# EAGLE schematic Schematic v24 (EAGLE 9.7.0)
Assembly variants: PCB
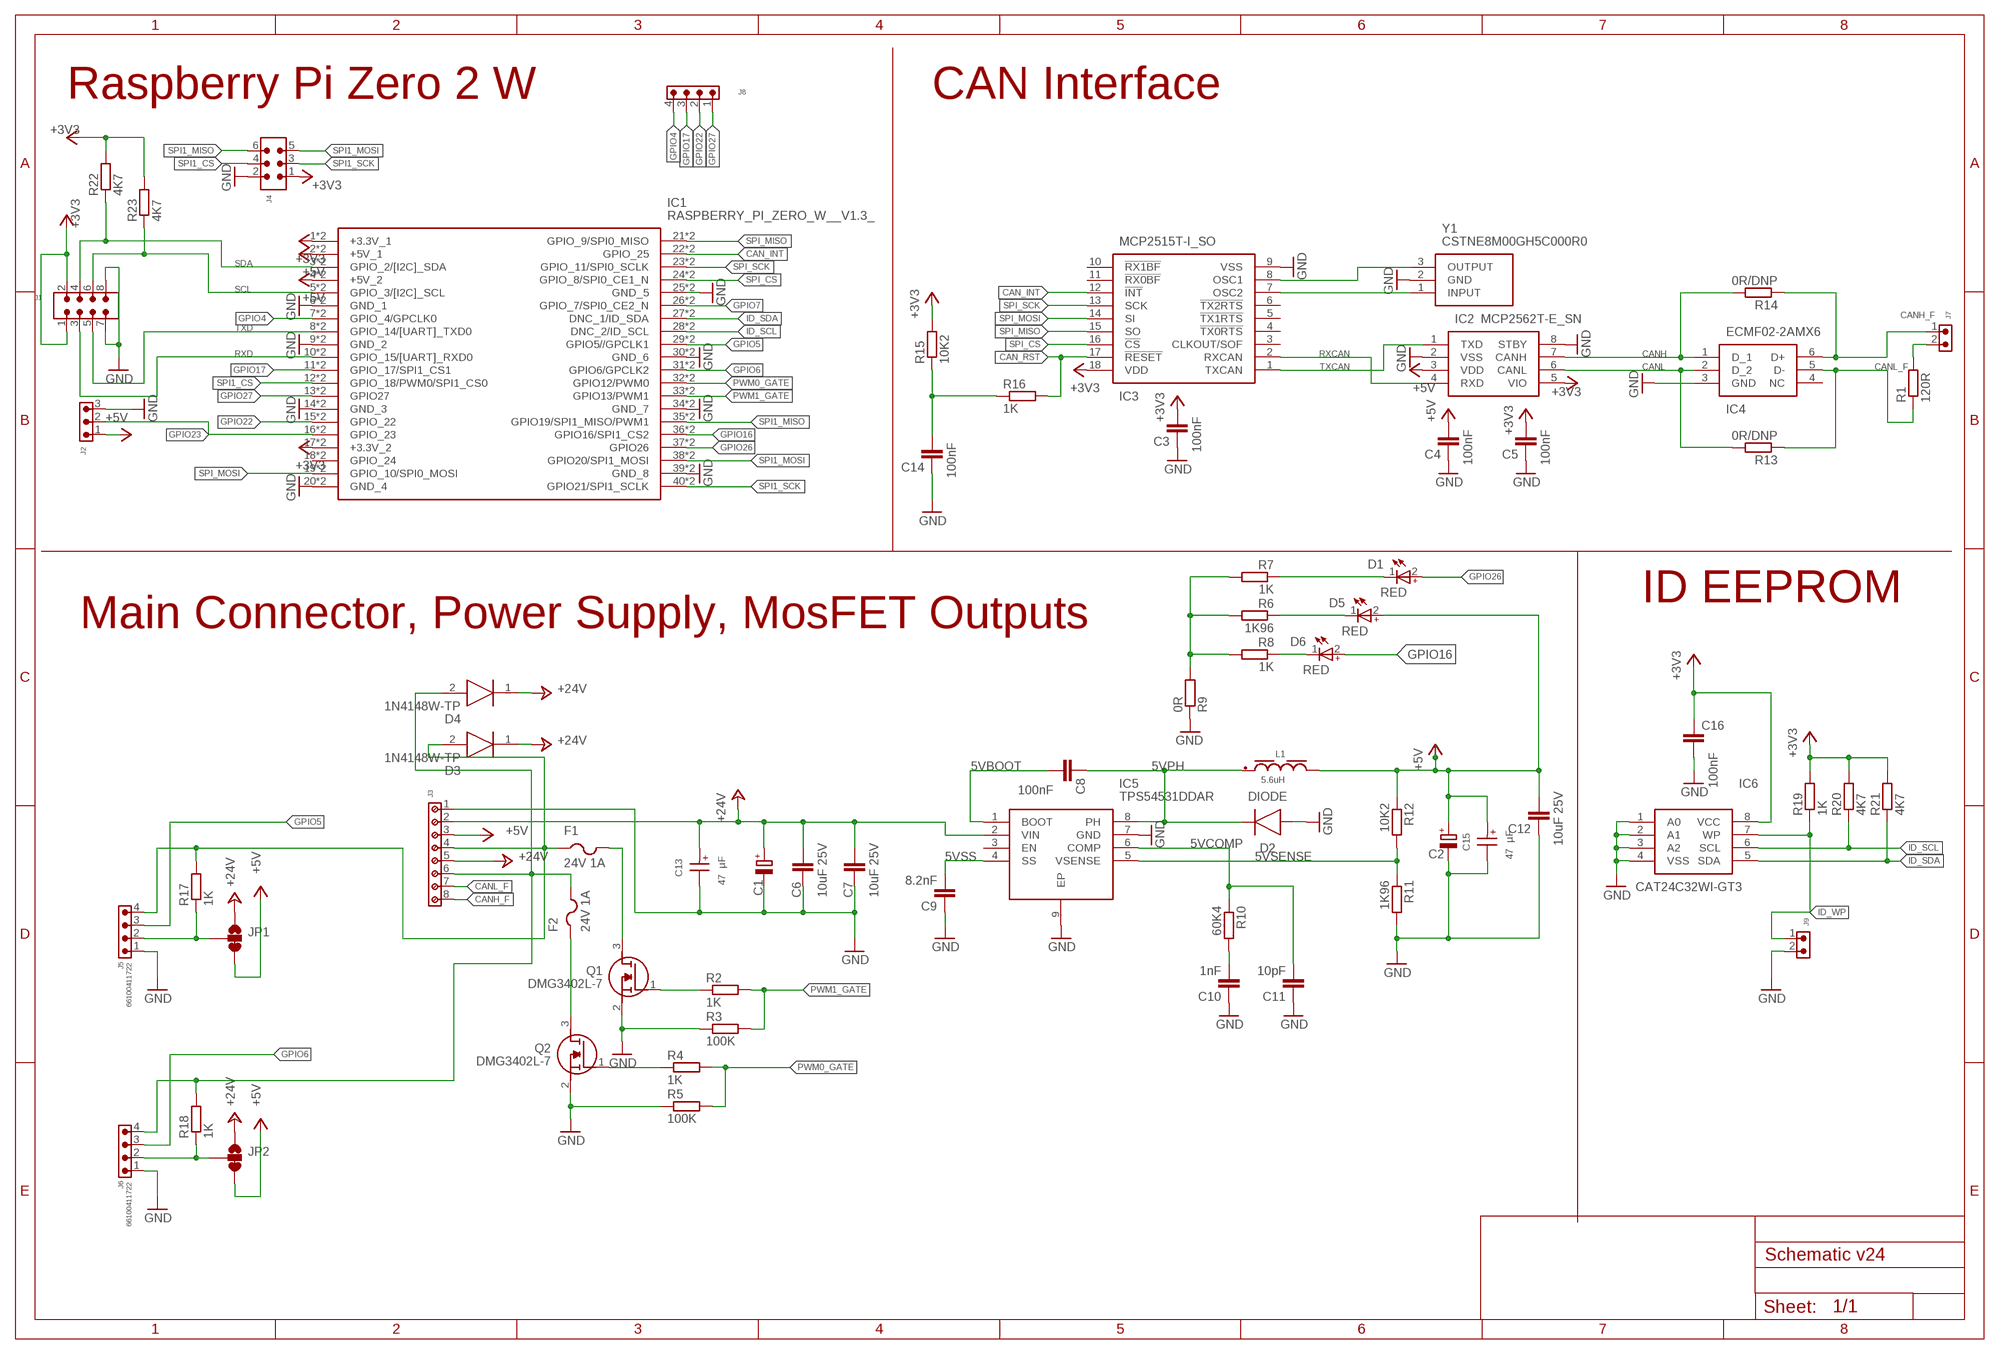
[diagram p0: schematic, sheet 1]

## Parts
C1  CPOL-EUE3.5-8  [E3,5-8]
C2  CPOL-EUE3.5-8  [E3,5-8]
C3  100nF  C-EUC0603K  [C0603K]
C4  100nF  C-EUC0603K  [C0603K]
C5  100nF  C-EUC0603K  [C0603K]
C6  10uF 25V  C-EUC1210K  [C1210K]
C7  10uF 25V  C-EUC1210K  [C1210K]
C8  100nF  C-EUC0603K  [C0603K]
C9  8.2nF  C-EUC0603K  [C0603K]
C10  1nF  C-EUC0603K  [C0603K]
C11  10pF  C-EUC0603K  [C0603K]
C12  10uF 25V  C-EUC1210K  [C1210K]
C13  47 µF  WCAP-ASLL_5X5.5_865060142003  [WCAP-ASLL_5X5.5(DXL)]
C14  100nF  C-EUC0603K  [C0603K]
C15  47 µF  WCAP-ASLL_5X5.5_865060142003  [WCAP-ASLL_5X5.5(DXL)]
C16  100nF  C-EUC0603K  [C0603K]
D1  RED  WL-SMCC_0603_R_V_Y_150060RS73220  [WL-SMCC_0603_R_Y_V]
D2  DIODE  DIODEDO-214AB(SMC)  [DIOM7959X625N]
D3  1N4148W-TP  [SOD3716X135N]
D4  1N4148W-TP  [SOD3716X135N]
D5  RED  WL-SMCC_0603_R_V_Y_150060RS73220  [WL-SMCC_0603_R_Y_V]
D6  RED  WL-SMCC_0603_R_V_Y_150060RS73220  [WL-SMCC_0603_R_Y_V]
F1  24V 1A  PTCFUSE-1206  [R1206]
F2  24V 1A  PTCFUSE-1206  [R1206]
IC1  RASPBERRY_PI_ZERO_W__V1.3_  [RASPBERRYPIZEROWV13]
IC2  MCP2562T-E_SN  [SOIC127P600X175-8N]
IC3  MCP2515T-I_SO  [SOIC127P1030X265-18N]
IC4  ECMF02-2AMX6  [SON50P150X170X55-6N]
IC5  TPS54531DDAR  [SOIC127P600X170-9N]
IC6  CAT24C32WI-GT3  [SOIC127P600X175-8N]
J1  6130XX21121_61300821121  [61300821121]
J2  6130XX11121_61300311121  [61300311121]
J3  691243110008  [691243110008]
J4  6130XX21121_61300621121  [61300621121]
J5  66100411722  66100411722  [66100411722]
J6  66100411722  66100411722  [66100411722]
J7  6130XX11121_61300211121  [61300211121]
J8  6130XX11021_61300411021  [61300411021]
J9  6130XX11121_61300211121  [61300211121]
JP1  JUMPER-SMT_3_1-NC_TRACE_NO-SILK  [SMT-JUMPER_3_1-NC_TRACE_NO-SILK]
JP2  JUMPER-SMT_3_1-NC_TRACE_NO-SILK  [SMT-JUMPER_3_1-NC_TRACE_NO-SILK]
L1  5.6uH  WE-PD_1050P_7447714056  [WE-PD_1050P]
Q1  DMG3402L-7  [SOT96P240X110-3N]
Q2  DMG3402L-7  [SOT96P240X110-3N]
R1  120R  R-EU_R0603  [R0603]
R2  1K  R-EU_R0603  [R0603]
R3  100K  R-EU_R0603  [R0603]
R4  1K  R-EU_R0603  [R0603]
R5  100K  R-EU_R0603  [R0603]
R6  1K96  R-EU_R0603  [R0603]
R7  1K  R-EU_R0603  [R0603]
R8  1K  R-EU_R0603  [R0603]
R9  0R  R-EU_R0603  [R0603]
R10  60K4  R-EU_R0603  [R0603]
R11  1K96  R-EU_R0603  [R0603]
R12  10K2  R-EU_R0603  [R0603]
R13  0R/DNP  R-EU_R0603  [R0603]
R14  0R/DNP  R-EU_R0603  [R0603]
R15  10K2  R-EU_R0603  [R0603]
R16  1K  R-EU_R0603  [R0603]
R17  1K  R-EU_R0603  [R0603]
R18  1K  R-EU_R0603  [R0603]
R19  1K  R-EU_R0603  [R0603]
R20  4K7  R-EU_R0603  [R0603]
R21  4K7  R-EU_R0603  [R0603]
R22  4K7  R-EU_R0603  [R0603]
R23  4K7  R-EU_R0603  [R0603]
Y1  CSTNE8M00GH5C000R0  [CSTNE12M0GH5L000R0]

## Nets
5VBOOT: C8.2 IC5.1(BOOT)
5VCOMP: C11.2 IC5.6(COMP) R10.1
5VPH: C8.1 D2.1(C) IC5.8(PH) L1.1
5VSENSE: IC5.5(VSENSE) R11.1 R12.2
5VSS: C9.2 IC5.4(SS)
+3V3: C3.2 C5.2 C16.1 IC1.1(+3.3V_1) IC1.1.2(+3.3V_1) IC1.17(+3.3V_2) IC1.17.2(+3.3V_2) IC2.5(VIO) IC3.18(VDD) IC6.8(VCC) J1.1 J1.2 J4.1 R15.2 R19.2 R20.2 R21.2 R22.2 R23.2
+5V: C2.+ C4.2 C12.2 C15.1(+) D5.2(+) IC1.2(+5V_1) IC1.2.2(+5V_1) IC1.4(+5V_2) IC1.4.2(+5V_2) IC2.3(VDD) J2.1 J3.3 JP1.3 JP2.3 L1.2 R12.1
+24V: C1.+ C6.2 C7.2 C13.1(+) D3.1(K) D4.1(K) IC5.2(VIN) J3.2 J3.5 JP1.1 JP2.1
CAN_INT: IC1.22(GPIO_25) IC1.22.2(GPIO_25) IC3.12(!INT)
CAN_RST: IC3.17(!RESET) R16.2
CANH: IC2.7(CANH) IC4.1(D_1) R14.2
CANH_F: IC4.6(D+) J3.8 J7.1 R14.1
CANL: IC2.6(CANL) IC4.2(D_2) R13.2
CANL_F: IC4.5(D-) J3.7 R1.1 R13.1
GND: C1.- C2.- C3.1 C4.1 C5.1 C6.1 C7.1 C9.1 C10.1 C11.1 C12.1 C13.2(-) C14.1 C15.2(-) C16.2 D2.2(A) IC1.6(GND_1) IC1.6.2(GND_1) IC1.9(GND_2) IC1.9.2(GND_2) IC1.14(GND_3) IC1.14.2(GND_3) IC1.20(GND_4) IC1.20.2(GND_4) IC1.25(GND_5) IC1.25.2(GND_5) IC1.30(GND_6) IC1.30.2(GND_6) IC1.34(GND_7) IC1.34.2(GND_7) IC1.39(GND_8) IC1.39.2(GND_8) IC2.2(VSS) IC2.8(STBY) IC3.9(VSS) IC4.3(GND) IC5.7(GND) IC5.9(EP) IC6.1(A0) IC6.2(A1) IC6.3(A2) IC6.4(VSS) J1.7 J1.8 J2.3 J3.1 J4.2 J5.1 J6.1 J9.2 Q1.2(S) Q2.2(S) R3.1 R5.1 R9.1 R11.2 Y1.2(GND)
GPIO4: IC1.7(GPIO_4/GPCLK0) IC1.7.2(GPIO_4/GPCLK0) J8.4
GPIO5: IC1.29(GPIO5//GPCLK1) IC1.29.2(GPIO5//GPCLK1) J5.3
GPIO6: IC1.31(GPIO6/GPCLK2) IC1.31.2(GPIO6/GPCLK2) J6.3
GPIO7: IC1.26(GPIO_7/SPI0_CE2_N) IC1.26.2(GPIO_7/SPI0_CE2_N)
GPIO16: D6.2(+) IC1.36(GPIO16/SPI1_CS2) IC1.36.2(GPIO16/SPI1_CS2)
GPIO17: IC1.11(GPIO_17/SPI1_CS1) IC1.11.2(GPIO_17/SPI1_CS1) J8.3
GPIO22: IC1.15(GPIO_22) IC1.15.2(GPIO_22) J8.2
GPIO23: IC1.16(GPIO_23) IC1.16.2(GPIO_23) J2.2
GPIO26: D1.2(+) IC1.37(GPIO26) IC1.37.2(GPIO26)
GPIO27: IC1.13(GPIO27) IC1.13.2(GPIO27) J8.1
ID_SCL: IC1.28(DNC_2/ID_SCL) IC1.28.2(DNC_2/ID_SCL) IC6.6(SCL) R20.1
ID_SDA: IC1.27(DNC_1/ID_SDA) IC1.27.2(DNC_1/ID_SDA) IC6.5(SDA) R21.1
ID_WP: IC6.7(WP) J9.1 R19.1
LED_B: D6.1(-) R8.1
LED_COMMON: R6.2 R7.2 R8.2 R9.2
LED_G: D5.1(-) R6.1
LED_R: D1.1(-) R7.1
N$1: J6.2 JP2.2 R18.1
N$2: J5.2 JP1.2 R17.1
N$4: C14.2 R15.1 R16.1
N$7: IC3.8(OSC1) Y1.3(OUTPUT)
N$8: IC3.7(OSC2) Y1.1(INPUT)
N$49: C10.2 R10.2
N$111: J7.2 R1.2
PWM0: Q2.1(G) R4.1
PWM0_FUSE: F2.1 Q2.3(D)
PWM0_GATE: IC1.32(GPIO12/PWM0) IC1.32.2(GPIO12/PWM0) R4.2 R5.2
PWM0_IN: D4.2(A) F2.2 J3.6 J6.4 R18.2
PWM1: Q1.1(G) R2.1
PWM1_FUSE: F1.2 Q1.3(D)
PWM1_GATE: IC1.33(GPIO13/PWM1) IC1.33.2(GPIO13/PWM1) R2.2 R3.2
PWM1_IN: D3.2(A) F1.1 J3.4 J5.4 R17.2
RXCAN: IC2.4(RXD) IC3.2(RXCAN)
RXD: IC1.10(GPIO_15/[UART]_RXD0) IC1.10.2(GPIO_15/[UART]_RXD0) J1.3
SCL: IC1.5(GPIO_3/[I2C]_SCL) IC1.5.2(GPIO_3/[I2C]_SCL) J1.6 R23.1
SDA: IC1.3(GPIO_2/[I2C]_SDA) IC1.3.2(GPIO_2/[I2C]_SDA) J1.4 R22.1
SPI1_CS: IC1.12(GPIO_18/PWM0/SPI1_CS0) IC1.12.2(GPIO_18/PWM0/SPI1_CS0) J4.4
SPI1_MISO: IC1.35(GPIO19/SPI1_MISO/PWM1) IC1.35.2(GPIO19/SPI1_MISO/PWM1) J4.6
SPI1_MOSI: IC1.38(GPIO20/SPI1_MOSI) IC1.38.2(GPIO20/SPI1_MOSI) J4.5
SPI1_SCK: IC1.40(GPIO21/SPI1_SCLK) IC1.40.2(GPIO21/SPI1_SCLK) J4.3
SPI_CS: IC1.24(GPIO_8/SPI0_CE1_N) IC1.24.2(GPIO_8/SPI0_CE1_N) IC3.16(!CS)
SPI_MISO: IC1.21(GPIO_9/SPI0_MISO) IC1.21.2(GPIO_9/SPI0_MISO) IC3.15(SO)
SPI_MOSI: IC1.19(GPIO_10/SPI0_MOSI) IC1.19.2(GPIO_10/SPI0_MOSI) IC3.14(SI)
SPI_SCK: IC1.23(GPIO_11/SPI0_SCLK) IC1.23.2(GPIO_11/SPI0_SCLK) IC3.13(SCK)
TXCAN: IC2.1(TXD) IC3.1(TXCAN)
TXD: IC1.8(GPIO_14/[UART]_TXD0) IC1.8.2(GPIO_14/[UART]_TXD0) J1.5
Unconnected: IC1.18(GPIO_24) IC1.18.2(GPIO_24) IC3.3(CLKOUT/SOF) IC3.4(!TX0RTS) IC3.5(!TX1RTS) IC3.6(!TX2RTS) IC3.10(!RX1BF) IC3.11(!RX0BF) IC4.4(NC) IC5.3(EN)

## Notes on the sheet
- Raspberry Pi Zero 2 W | CAN Interface
- ID EEPROM
- Main Connector, Power Supply, MosFET Outputs

## Library data of the parts
C1 C2 = rcl:CPOL-EU: POLARIZED CAPACITOR, European symbol; SPICEPREFIX: C
C3-C12 C14 C16 = rcl:C-EU: CAPACITOR, European symbol; SPICEPREFIX: C
C13 C15 = Wurth_Capacitors_WCAP-ASLL:WCAP-ASLL_5X5.5: WCAP-ASLL Aluminium Electrolytic Capacitors Low Impedance & Long Life +105 °C Characteristics Low impedance and long life product series Mounting style: V-Chip SMT Capacitance range: 1 µF ‒ 6800 µF Capacitance tolerance: ±20 % Voltage range (UR): 6.3 ‒ 450 V(DC) Operating temperature: -55 °C up to +105 °C for UR ≤ 100 V(DC) -40 °C up to +105 °C for UR > 100 V(DC) Endurance: 2000 ‒ 5000 h @ +105 °C Dimensions (DxL) in mm: 4.0 x 5.5 up to 16.0 x 17.0 Recommended soldering: Reflow soldering Applications Long life application & low impedance Input and output capacitor for switched-mode power supply Filtering Smoothing e.g. DC/DC converter, AC/DC converter, satellite receiver, control panel <https://www.we-online.com/catalog/media/o14724v209%20Family_WCAP-ASLL.jpg> Details see: https://www.we-online.com/catalog/en/WCAP-ASLL/ Updated by yingchun,Shan;2020-03-03 2020(C) Würth Elektronik; DATASHEET-URL: https://www.we-online.com/catalog/datasheet/865060142003.pdf; DF: 22%; DIAMETER: 5mm; I-LEAK: 3uA; I-RIPPLE: 160mA; L: 5.5mm; OPERATING-TEMPERATURE: -55 °C up to +105 °C; PART-NUMBER: 865060142003; TECHNICAL-REFERENCE: ASEC055470M6R3DVCTBB000; VR: 6.3V(DC); Z: 0.8Ohm
D1 D5 D6 = Wurth_LEDs_WL-SMCC:WL-SMCC_0603_R_V_Y: WL-SMCC SMT Mono-color Chip LED Compact Characteristics Small LED package for exceptional brightness 0402 industry standard footprint High reliability PCB based Compatible to IR reflow soldering Miniaturized color effects Waterclear lens Applications LED Front panel indicator Navigation systems Cellphone display Display for industrial control systems Traffic display LCD backlighting for LCD, push button, symbol and keypad <https://www.we-online.com/catalog/media/o136747v209%20Family_WL-SMCC_0402.jpg> Details see: https://www.we-online.com/catalog/en/WL-SMCC/ Updated By Yingchun Shan,2020-03-18 2020 (C) Wurth Elektronik; ABSTRAHLWINKEL: 120°; CHIP-TECHNOLOGY: AlInGaP; DATASHEET-URL: https://www.we-online.com/catalog/datasheet/150060RS73220.pdf; EMITTING-COLOR: Red; I-V-TYP: 90mcd; LAMDA-DOM-TYP: 624nm; LAMDA-PEAK-TYP: 632nm; PART-NUMBER: 150060RS73220; V-F-TYP: 2V
D2 = Diode:DIODE: Diode Rectifier - Generic; CATEGORY: Diode; SUB-CATEGORY: Rectifier
D3 D4 = pke:1N4148W-TP: MICRO COMMERCIAL COMPONENTS - 1N4148W-TP - SWITCHING DIODE, 150mA, 100V, SOD123, FULL REEL Source: Datasheet <https://componentsearchengine.com/Datasheets/2/1N4148W-TP.pdf>; ARROW_PART_NUMBER: 1N4148W-TP; ARROW_PRICE-STOCK: https://www.arrow.com/en/products/1n4148w-tp/micro-commercial-components; DESCRIPTION: MICRO COMMERCIAL COMPONENTS - 1N4148W-TP - SWITCHING DIODE, 150mA, 100V, SOD123, FULL REEL; HEIGHT: 1.35mm; MANUFACTURER_NAME: Micro Commercial Components (MCC); MANUFACTURER_PART_NUMBER: 1N4148W-TP; MOUSER_PART_NUMBER: 833-1N4148W-TP; MOUSER_PRICE-STOCK: https://www.mouser.co.uk/ProductDetail/Micro-Commercial-Components-MCC/1N4148W-TP?qs=KFo7JewZbUH7wCMabJ4EeQ%3D%3D
F1 F2 = adafruit:PTCFUSE: PTC fuses, resettable thermistors
IC1 = Library:RASPBERRY_PI_ZERO_W__V1.3_: Raspberry Pi Zero W (v1.3) Single-board Computers Source: Datasheet <https://cdn.sparkfun.com/assets/learn_tutorials/6/7/6/PiZero_1.pdf>; DESCRIPTION: Raspberry Pi Zero W (v1.3) Single-board Computers; HEIGHT: mm; MANUFACTURER_NAME: RASPBERRY-PI; MANUFACTURER_PART_NUMBER: Raspberry Pi Zero W (v1.3)
IC2 = Library:MCP2562T-E_SN: MICROCHIP - MCP2562T-E/SN - , CAN, ISO11898-2/5, CAN, 4.5 V, 5.5 V, NSOIC Source: Datasheet <https://4donline.ihs.com/images/VipMasterIC/IC/MCHP/MCHPS05677/MCHPS05677-1.pdf?hkey=6D3A4C79FDBF58556ACFDE234799DDF0>; ARROW_PART_NUMBER: MCP2562T-E/SN; ARROW_PRICE-STOCK: https://www.arrow.com/en/products/mcp2562t-esn/microchip-technology?region=nac; DESCRIPTION: MICROCHIP - MCP2562T-E/SN - , CAN, ISO11898-2/5, CAN, 4.5 V, 5.5 V, NSOIC; HEIGHT: 1.75mm; MANUFACTURER_NAME: Microchip; MANUFACTURER_PART_NUMBER: MCP2562T-E/SN; MOUSER_PART_NUMBER: 579-MCP2562T-E/SN; MOUSER_PRICE-STOCK: https://www.mouser.co.uk/ProductDetail/Microchip-Technology/MCP2562T-E-SN?qs=eTPcRhULBzyVnEfrVUWSlA%3D%3D
IC3 = Library:MCP2515T-I_SO: Microchip Technology MCP2515T-I/SO, CAN Controller 1Mbit/s, 18-Pin SOIC Source: Datasheet <https://datasheet.datasheetarchive.com/originals/distributors/SFDatasheet-4/sf-00090060.pdf>; ARROW_PART_NUMBER: MCP2515T-I/SO; ARROW_PRICE-STOCK: https://www.arrow.com/en/products/mcp2515t-iso/microchip-technology?region=nac; DESCRIPTION: Microchip Technology MCP2515T-I/SO, CAN Controller 1Mbit/s, 18-Pin SOIC; HEIGHT: 2.65mm; MANUFACTURER_NAME: Microchip; MANUFACTURER_PART_NUMBER: MCP2515T-I/SO; MOUSER_PART_NUMBER: 579-MCP2515T-I/SO; MOUSER_PRICE-STOCK: https://www.mouser.co.uk/ProductDetail/Microchip-Technology/MCP2515T-I-SO?qs=uMUszenkLLKzXVzy0vTLgQ%3D%3D
IC4 = pke:ECMF02-2AMX6: Common Mode Filter & ESD Prot. USB uQFN6 STMicroelectronics ECMF02 Series, Signal Filter, 200mA uQFN SMD, Flat Contact Termination, 1.8 x 1.6 x 0.5mm Source: Datasheet <http://www.st.com/content/ccc/resource/technical/document/datasheet/3a/28/cf/d0/31/63/48/8c/CD00282307.pdf/files/CD00282307.pdf/jcr:content/translations/en.CD00282307.pdf>; DESCRIPTION: Common Mode Filter & ESD Prot. USB uQFN6 STMicroelectronics ECMF02 Series, Signal Filter, 200mA uQFN SMD, Flat Contact Termination, 1.8 x 1.6 x 0.5mm; HEIGHT: 0.55mm; MANUFACTURER_NAME: STMicroelectronics; MANUFACTURER_PART_NUMBER: ECMF02-2AMX6; MOUSER_PART_NUMBER: 511-ECMF02-2AMX6; MOUSER_PRICE-STOCK: https://www.mouser.com/Search/Refine.aspx?Keyword=511-ECMF02-2AMX6; RS_PART_NUMBER: 8805276P; RS_PRICE-STOCK: http://uk.rs-online.com/web/p/products/8805276P
IC5 = pke:TPS54531DDAR: 3.5V to 28V Input, 5A, 570kHz Step-Down Converter with Eco-mode Source: Datasheet <http://www.ti.com/lit/gpn/tps54531>; ARROW_PART_NUMBER: TPS54531DDAR; ARROW_PRICE-STOCK: https://www.arrow.com/en/products/tps54531ddar/texas-instruments?region=nac; DESCRIPTION: 3.5V to 28V Input, 5A, 570kHz Step-Down Converter with Eco-mode; HEIGHT: 1.7mm; MANUFACTURER_NAME: Texas Instruments; MANUFACTURER_PART_NUMBER: TPS54531DDAR; MOUSER_PART_NUMBER: 595-TPS54531DDAR; MOUSER_PRICE-STOCK: https://www.mouser.co.uk/ProductDetail/Texas-Instruments/TPS54531DDAR?qs=jA5Ki6243onykODzUePbag%3D%3D
IC6 = Library:CAT24C32WI-GT3: EEPROM Serial-I2C 32K 4Kx8 1.8V/5V SOIC8 CAT24C32WI-GT3, EEPROM Memory 32kbit,, 4096 x, 8bit, Serial-I2C 1.7 5.5 V, 8-Pin SOIC Source: Datasheet <http://www.onsemi.com/pub/Collateral/CAT24C32-D.PDF>; ARROW_PART_NUMBER: CAT24C32WI-GT3; ARROW_PRICE-STOCK: https://www.arrow.com/en/products/cat24c32wi-gt3/on-semiconductor; DESCRIPTION: EEPROM Serial-I2C 32K 4Kx8 1.8V/5V SOIC8 CAT24C32WI-GT3, EEPROM Memory 32kbit,, 4096 x, 8bit, Serial-I2C 1.7 5.5 V, 8-Pin SOIC; HEIGHT: 1.75mm; MANUFACTURER_NAME: onsemi; MANUFACTURER_PART_NUMBER: CAT24C32WI-GT3; MOUSER_PART_NUMBER: 698-CAT24C32WI-GT3; MOUSER_PRICE-STOCK: https://www.mouser.co.uk/ProductDetail/onsemi/CAT24C32WI-GT3?qs=rZgeL6XvLwaTa79VuYkKQA%3D%3D
J1 = Wurth_Connectors_WR-PHD:6130XX21121_61300821121: WR-PHD 2.54 mm THT Dual Pin Header ARTICLE PROPERTIES: Pins:4;​ 6;​ 8;​ 10;​ 12;​ 14;​ 16;​ 18;​ 20;​ 22;​ 24;​ 26;​ 28;​ 30;​ 32;​ 34;​ 36;​ 40;​ 44;​ 64;​ 72;​ 80 KIND PROPERTIES: Pitch：2.54 mm Quality Class:3 as per CECC 75 301-802 Rows：Dual Gender：Pin Header Type：Board Stacker MATERIAL PROPERTIES: Insulator Material :PA6T Insulator Flammability Rating:UL94 V-0 Contact Material:Copper Alloy Contact Plating:Gold Contact Type:Stamped GENERAL INFORMATION Operating Temperature:-40 up to +105 °C Compliance:Lead free / RoHS ELECTRICAL PROPERTIES: Rated Current:3 A IR 1:3 A Withstanding Voltage:500 V (AC) Contact Resistance:20 mΩ RISO:1000 MΩ CERTIFICATION UL Approval:E323964 PACKAGING PROPERTIES Packaging:Bag <https://katalog.we-online.com/media/images/v2/o33215v209%20Family_WR-PHD_6130xx21121.jpg> Details see: https://katalog.we-online.com/en/em/PHD_2_54_THT_DUAL_PIN_HEADER_6130XX21121 Updated by Yingchun,Shan 2019-10-16 2019 (C) Würth Elektronik; DATASHEET-URL: https://katalog.we-online.com/em/datasheet/61300821121.pdf; GENDER: Pin Header; IR: 3A; MATES: WR-PHD 2.54mm Angled DualSocket Header/Dual Socket Header/Dual Socket Header Bottom Entry/Dual Socket Header Bottom Entry Large/SMT Dual Socket Header/SMT Dual Socket Header Bottom Entry; PACKAGING: Bag; PART-NUMBER: 61300821121; PINS: 8; ROWS: Dual; TYPE: Board Stacker
J2 = Wurth_Connectors_WR-PHD:6130XX11121_61300311121: WR-PHD 2.54 mm THT Pin Header ARTICLE PROPERTIES: Pins:1;​ 2;​ 3;​ 4;​ 5;​ 6;​ 7;​ 8;​ 9;​ 10;​ 12;​ 13;​ 14;​ 15;​ 16;​ 18;​ 20;​ 22;​ 24;​ 25;​ 32;​ 36;​ 40 KIND PROPERTIES: Pitch：2.54 mm Quality Class:3 as per CECC 75 301-802 Rows：Single Gender：Pin Header Type：Straight MATERIAL PROPERTIES: Insulator Material :PBT Insulator Flammability Rating:UL94 V-0 Contact Material:Copper Alloy Contact Plating:Gold Contact Type:Stamped GENERAL INFORMATION Operating Temperature:-40 up to +105 °C Compliance:RoHS ELECTRICAL PROPERTIES: Rated Current:3 A IR 1:3 A Withstanding Voltage:500 V (AC) Contact Resistance:20 mΩ RISO:1000 MΩ CERTIFICATION UL Approval:E323964 PACKAGING PROPERTIES Packaging:Bag <https://katalog.we-online.com/media/images/v2/o33211v209%20Family_BTB_PHD_6130xx11121.jpg> Details see: https://katalog.we-online.com/en/em/PHD_2_54_THT_PIN_HEADER_6130XX11121 Updated by Yingchun,Shan 2019-10-16 2019 (C) Würth Elektronik; DATASHEET-URL: https://katalog.we-online.com/em/datasheet/61300311121.pdf; GENDER: Pin Header; IR: 3A; MATES: WR-PHD 2.54mm Angled Socket Header /SMT Socket Header/Socket Header; PACKAGING: Bag; PART-NUMBER: 61300311121; PINS: 3; ROWS: Single; TYPE: Straight
J3 = Wurth_Connectors_WR-TBL Rising Cage Clamp:691243110008: WR-TBL Serie 2431 - 3.50 mm Horizontal cable entry with rising clamp KIND PROPERTIES Pitch 3.5 mm MATERIAL PROPERTIES Insulator Material PA6/66 Insulator Flammability Rating UL94 V-0 Insulator Color Green Contact Material Copper Alloy Contact Plating Nickel over Tin Contact Type Stamped Terminal Screw Material Steel Terminal Screw Plating Zinc Wire Guard Material Copper Alloy GENERAL INFORMATION Operating Temperature -30 up to +120 °C Compliance Lead free / RoHS ELECTRICAL PROPERTIES IR UL 10 A IR VDE 10 A Working Voltage [UL] 300 V (AC) Working Voltage [VDE] 130 V (AC) Withstanding Voltage [UL] 1600 V (AC) Withstanding Voltage [VDE] 1250 V (AC) Contact Resistance 20 mΩ Contact Resistance [UL] 20 mΩ Contact Resistance [VDE] 20 mΩ MECHANICAL PROPERTIES Wire Strip Length 6 (mm) Screw M2 Solid Wire Section (AWG) 30 to 16 (AWG) Solid Wire Section (Metric) 0.05 to 1.31 (mm²) Stranded Wire Section (AWG) 30 to 16 (AWG) Stranded Wire Section (Metric) 0.05 to 1.31 (mm²) CERTIFICATION UL Approval E150931 CAT. N°: CPA (3) VDE Approval 40015434 VDE Approval 40015434 TYPE: CPA PACKAGING PROPERTIES Packaging Box <https://katalog.we-online.com/media/images/v2/o32893v209%20Family_WR-TBL2_Series2431.jpg> Details see: https://katalog.we-online.com/en/em/TBL_3_50_2431_HORIZONTAL_ENTRY_MODULAR_W_RISING_CAGE_6912431100xx Updated by Ella Wu 2019-11-12 2019(C) Wurth Elektronik; DATASHEET-URL: https://www.we-online.com/catalog/datasheet/691243110008.pdf; IR-UL: 10A; IR-VDE: 10A; MOUNT: THT; PART-NUMBER: 691243110008; PINS: 8; PITCH: 3.5mm; TYPE: Horizontal; WIRE: 30 to 16 (AWG) 0.05 to 1.31 (mm²); WORKING-VOLTAGE-UL: 300V (AC); WORKING-VOLTAGE-VDE: 130V (AC)
J4 = Wurth_Connectors_WR-PHD:6130XX21121_61300621121: WR-PHD 2.54 mm THT Dual Pin Header ARTICLE PROPERTIES: Pins:4;​ 6;​ 8;​ 10;​ 12;​ 14;​ 16;​ 18;​ 20;​ 22;​ 24;​ 26;​ 28;​ 30;​ 32;​ 34;​ 36;​ 40;​ 44;​ 64;​ 72;​ 80 KIND PROPERTIES: Pitch：2.54 mm Quality Class:3 as per CECC 75 301-802 Rows：Dual Gender：Pin Header Type：Board Stacker MATERIAL PROPERTIES: Insulator Material :PA6T Insulator Flammability Rating:UL94 V-0 Contact Material:Copper Alloy Contact Plating:Gold Contact Type:Stamped GENERAL INFORMATION Operating Temperature:-40 up to +105 °C Compliance:Lead free / RoHS ELECTRICAL PROPERTIES: Rated Current:3 A IR 1:3 A Withstanding Voltage:500 V (AC) Contact Resistance:20 mΩ RISO:1000 MΩ CERTIFICATION UL Approval:E323964 PACKAGING PROPERTIES Packaging:Bag <https://katalog.we-online.com/media/images/v2/o33215v209%20Family_WR-PHD_6130xx21121.jpg> Details see: https://katalog.we-online.com/en/em/PHD_2_54_THT_DUAL_PIN_HEADER_6130XX21121 Updated by Yingchun,Shan 2019-10-16 2019 (C) Würth Elektronik; DATASHEET-URL: https://katalog.we-online.com/em/datasheet/61300621121.pdf; GENDER: Pin Header; IR: 3A; MATES: WR-PHD 2.54mm Angled DualSocket Header/Dual Socket Header/Dual Socket Header Bottom Entry/Dual Socket Header Bottom Entry Large/SMT Dual Socket Header/SMT Dual Socket Header Bottom Entry; PACKAGING: Bag; PART-NUMBER: 61300621121; PINS: 6; ROWS: Dual; TYPE: Board Stacker
J5 J6 = Wurth_Connectors_WR-WTB:66100411722: WR-WTB 2.54 mm Male Right Angled Shrouded Header KIND PROPERTIES: Pitch:2.54 mm Gender:Male MATERIAL PROPERTIES: Insulator Material :PA46 Insulator Flammability Rating:UL94 V-0 Color:Black Contact Material:Phosphor Bronze Contact Plating:Tin GENERAL INFORMATION Operating Temperature:-40 up to +105 °C Compliance: RoHS Working Voltage:50 V (AC) Withstanding Voltage:500 V (AC) Contact Resistance:20 mΩ PACKAGING PROPERTIES Packaging:Box <https://katalog.we-online.com/media/images/v2/o58906v209%20Family_WR-WTB_Vertical_Shrouded_Header_6610xx11722_2.54_SW.jpg> Details see: https://katalog.we-online.com/en/em/WTB_2_54_MALE_RIGHT_ANGLED_SHROUDED_HEADER_GLOW_WIRE_PLASTIC_6610XXX1722 Updated by Yingchun,Shan 2019-11-05 2019 (C) Würth Elektronik; CONTACT-RESISTANCE: 20mOhm; DATASHEET-URL: https://www.we-online.com/catalog/datasheet/66100411722.pdf; GENDER: Male; IR: 3A; L: 9.86mm; MOUNT: THT; PACKAGING: Box; PART-NUMBER: 66100411722; PCB-CABLE-PANEL: PCB; PINS: 4; PITCH: 2.54mm; TOL-R: max.; TYPE: Right Angled; WORKING-VOLTAGE: 50V(AC)
J7 J9 = Wurth_Connectors_WR-PHD:6130XX11121_61300211121: WR-PHD 2.54 mm THT Pin Header ARTICLE PROPERTIES: Pins:1;​ 2;​ 3;​ 4;​ 5;​ 6;​ 7;​ 8;​ 9;​ 10;​ 12;​ 13;​ 14;​ 15;​ 16;​ 18;​ 20;​ 22;​ 24;​ 25;​ 32;​ 36;​ 40 KIND PROPERTIES: Pitch：2.54 mm Quality Class:3 as per CECC 75 301-802 Rows：Single Gender：Pin Header Type：Straight MATERIAL PROPERTIES: Insulator Material :PBT Insulator Flammability Rating:UL94 V-0 Contact Material:Copper Alloy Contact Plating:Gold Contact Type:Stamped GENERAL INFORMATION Operating Temperature:-40 up to +105 °C Compliance:RoHS ELECTRICAL PROPERTIES: Rated Current:3 A IR 1:3 A Withstanding Voltage:500 V (AC) Contact Resistance:20 mΩ RISO:1000 MΩ CERTIFICATION UL Approval:E323964 PACKAGING PROPERTIES Packaging:Bag <https://katalog.we-online.com/media/images/v2/o33211v209%20Family_BTB_PHD_6130xx11121.jpg> Details see: https://katalog.we-online.com/en/em/PHD_2_54_THT_PIN_HEADER_6130XX11121 Updated by Yingchun,Shan 2019-10-16 2019 (C) Würth Elektronik; DATASHEET-URL: https://katalog.we-online.com/em/datasheet/61300211121.pdf; GENDER: Pin Header; IR: 3A; MATES: WR-PHD 2.54mm Angled Socket Header /SMT Socket Header/Socket Header; PACKAGING: Bag; PART-NUMBER: 61300211121; PINS: 2; ROWS: Single; TYPE: Straight
J8 = Wurth_Connectors_WR-PHD:6130XX11021_61300411021: WR-PHD 2.54 mm THT Angled Pin Header ARTICLE PROPERTIES: Pins:2;​ 3;​ 4;​ 5;​ 6;​ 7;​ 8;​ 9;​ 10;​ 12;​ 14;​ 16;​ 18;​ 22;​ 32;​ 34;​ 36;​ 40 KIND PROPERTIES: Pitch：2.54 mm Quality Class:3 as per CECC 75 301-802 Rows：Single Gender：Pin Header Type：Angled MATERIAL PROPERTIES: Insulator Material :PA6T Insulator Flammability Rating:UL94 V-0 Contact Material:Copper Alloy Contact Plating:Gold Contact Type:Stamped GENERAL INFORMATION Operating Temperature:-40 up to +105 °C Compliance:Lead free / RoHS ELECTRICAL PROPERTIES: Rated Current:3 A IR 1:3 A Withstanding Voltage:500 V (AC) Contact Resistance:20 mΩ RISO:1000 MΩ CERTIFICATION UL Approval:E323964 PACKAGING PROPERTIES Packaging:Bag <https://katalog.we-online.com/media/images/v2/o33210v209%20Family_WR-PHD_6130xx11021.jpg> Details see: https://katalog.we-online.com/en/em/PHD_2_54_THT_ANGLED_PIN_HEADER_6130XX11021 Updated by Yingchun,Shan 2019-10-16 2019 (C) Würth Elektronik; DATASHEET-URL: https://katalog.we-online.com/em/datasheet/61300411021.pdf; GENDER: Pin Header; IR: 3A; MATES: WR-PHD 2.5mm Angled Socket Header/SMT Socket Header/Socket Header/Soket Header Bottom Entry; PACKAGING: Bag; PART-NUMBER: 61300411021; PINS: 4; ROWS: Single; TYPE: Angled
JP1 JP2 = SparkFun-Jumpers:JUMPER-SMT_3_1-NC_TRACE: Normally closed trace jumper (1 of 2 connections) This jumper has a trace between two pads so it's normally closed (NC). The other connection is normally open (NO). Use a razor knife to open the connection. For best results follow the IPC guidelines for cutting traces: Cutout at least 0.063 mm (0.005 in). Remove all loose material to clean up the cut area. Seal the cut with an approved epoxy. Reapply solder to reclose the connection, or to close the NO connection.
L1 = Wurth_Power Magnetics_WE-PD:WE-PD_1050P: WE-PD SMT Power Inductor Characteristics AECQ 200 Qualified Ultra low RDC and RAC Highest possible saturation current based on Ferrite Suitable for switching frequency up to 10MHz Temperature dependent parameter available on Redexpert Operating Temperature from -40°C to +125°C / +150°C Types WE-PD: Since always with low loss material, tight tolerances and high saturation behavior compared to other manufacturers in the market WE-PD Robust: Plastic base improves the mechanical stability and efficiency WE-PD Performance: MnZn core improves Saturation and RDC for highest efficiency Applications Switch Mode Power supplies from 0,1W up to 300W Integrated DC DC Converter Ideal for Switch Mode Power supplies with extreme high efficiency (>95%) <https://www.we-online.com/catalog/media/o14825v209%20Family_WE-PD.jpg> Details see: https://www.we-online.com/catalog/en/WE-PD/ Updated by Yingchun,Shan 2019-07-25 2019 (C) Wurth Elektronik; DATASHEET-URL: https://www.we-online.com/catalog/datasheet/7447714056.pdf; FRES: 28MHz; IR: 6A; ISAT: 7.2A; JLC: C149541; MOUNT: SMT; PART-NUMBER: 7447714056; RDC-MAX: 14.4mOhm; RDC-TYP: 12mOhm; VERSION: Performance
Q1 Q2 = pke:DMG3402L-7: Diodes Inc DMG3402L-7 N-channel MOSFET Transistor, 4 A, 30 V, 3-Pin SOT-23 Source: Datasheet <https://www.diodes.com/assets/Datasheets/DMG3402L.pdf>; ARROW_PART_NUMBER: DMG3402L-7; ARROW_PRICE-STOCK: https://www.arrow.com/en/products/dmg3402l-7/diodes-incorporated; DESCRIPTION: Diodes Inc DMG3402L-7 N-channel MOSFET Transistor, 4 A, 30 V, 3-Pin SOT-23; HEIGHT: 1.1mm; MANUFACTURER_NAME: Diodes Inc.; MANUFACTURER_PART_NUMBER: DMG3402L-7; MOUSER_PART_NUMBER: 621-DMG3402L-7; MOUSER_PRICE-STOCK: https://www.mouser.co.uk/ProductDetail/Diodes-Incorporated/DMG3402L-7?qs=M%2FOdCRO8QQ3OmR%252BxqWZuSw%3D%3D
R1-R23 = rcl:R-EU_: RESISTOR, European symbol; SPICEPREFIX: R
Y1 = pke:CSTNE8M00GH5C000R0: Resonators 8.0000MHz 33pF SMD CHP Rsntr 0.07% AUTO Source: Datasheet <https://www.murata.com/en-eu/products/productdata/8801161773086/SPEC-CSTNE8M00GH5C000R0.pdf?1559743212000>; DESCRIPTION: Resonators 8.0000MHz 33pF SMD CHP Rsntr 0.07% AUTO; HEIGHT: 0.8mm; MANUFACTURER_NAME: Murata Electronics; MANUFACTURER_PART_NUMBER: CSTNE8M00GH5C000R0; MOUSER_PART_NUMBER: 81-CSTNE8M00GH5C000R; MOUSER_PRICE-STOCK: https://www.mouser.com/Search/Refine.aspx?Keyword=81-CSTNE8M00GH5C000R